# Altium schematic sheet Aq1A_Guppy.SchDoc
size A3; SheetNumber: 1; SheetTotal: 1; SPICEModelCacheADGYIUXI: <root> / <DocumentId>ADGYIUXI</DocumentId> / </root>
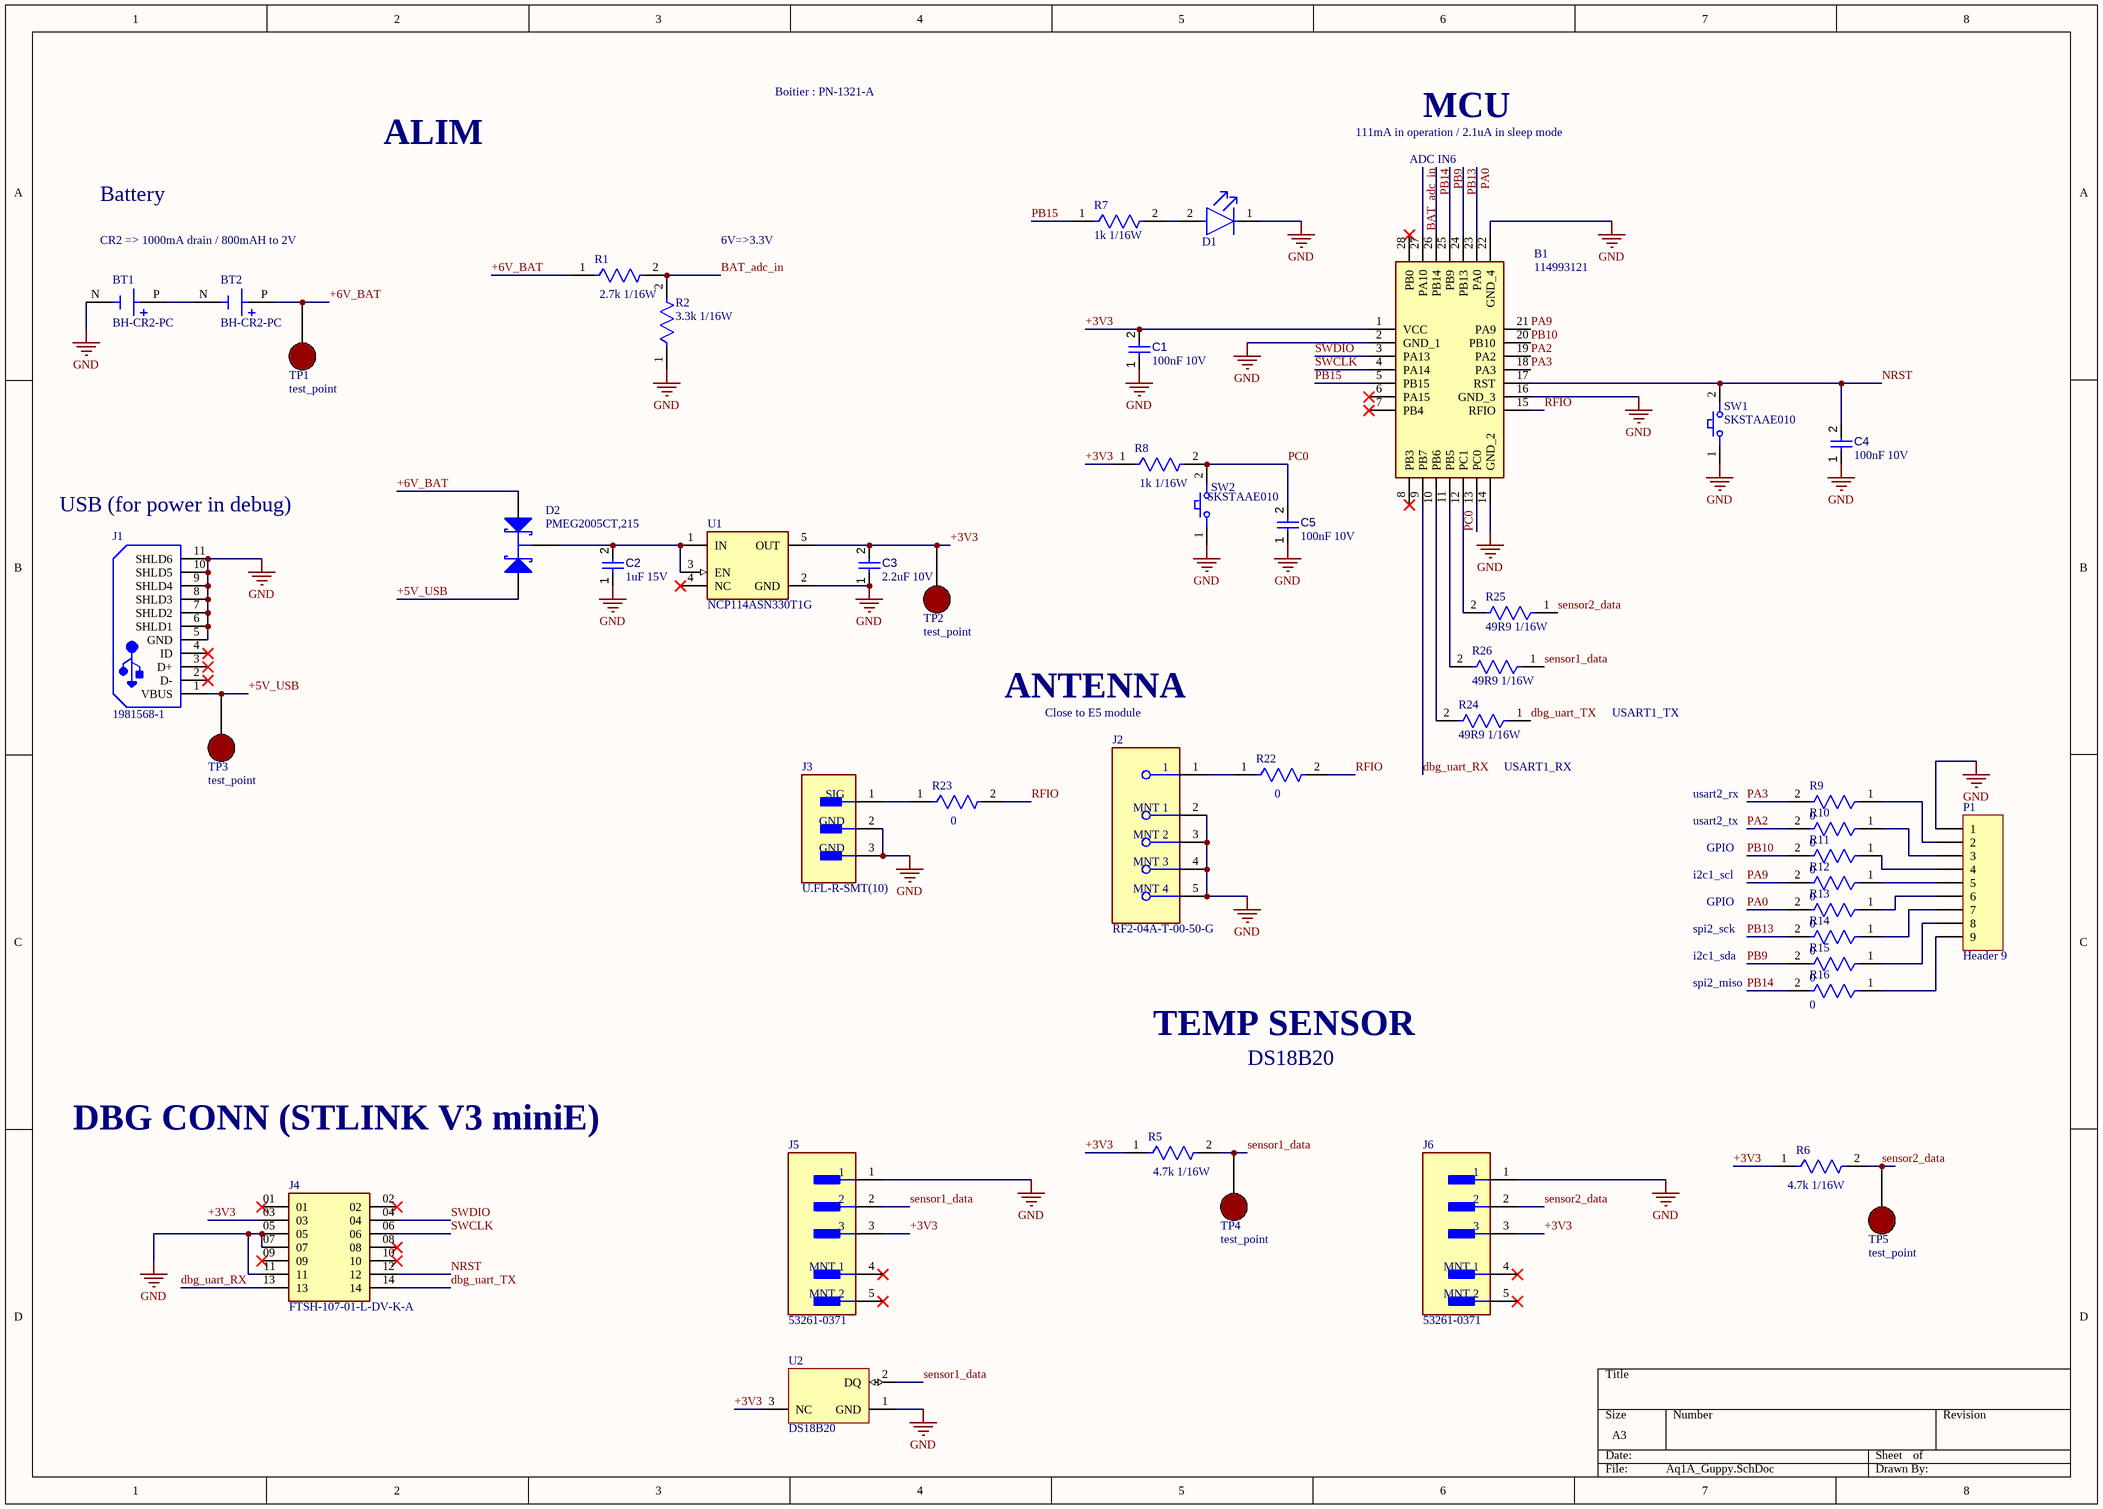
[diagram p0: Aq1A_Guppy.SchDoc]

## Parts
B1  114993121  [114993121]
BT1  BH-CR2-PC  [BAT_BH-CR2-PC]
BT2  BH-CR2-PC  [BAT_BH-CR2-PC]
C1  value 100nF 10V  [CAPC2013X95X50LL10T25]  (hidden comment: Capacitor 100 nF +/-10% 50 V 0805)
C2  value 1uF 15V  [CAPC2013X95X50LL10T25]  (hidden comment: Capacitor 100 nF +/-10% 50 V 0805)
C3  value 2.2uF 10V  [CAPC2013X95X50LL10T25]  (hidden comment: Capacitor 100 nF +/-10% 50 V 0805)
C4  value 100nF 10V  [CAPC2013X95X50LL10T25]  (hidden comment: Capacitor 100 nF +/-10% 50 V 0805)
C5  value 100nF 10V  [CAPC2013X95X50LL10T25]  (hidden comment: Capacitor 100 nF +/-10% 50 V 0805)
D1  SML-D12V8WT86C  [FP-SML-D12-MFG]  (value not drawn)
D2  PMEG2005CT,215  [STM-BAT54CFILM-3_V]
J1  1981568-1  [TECO-1981568-5_V]
J2  RF2-04A-T-00-50-G  [FP-RF2-04A-T-00-50-G-MFG]
J3  U.FL-R-SMT(10)  [FP-U_FL-R-SMT_10-MFG]
J4  FTSH-107-01-L-DV-K-A  [SAMTEC_FTSH-107-01-L-DV-K-A]
J5  53261-0371  [FP-53261-0371-MFG]
J6  53261-0371  [FP-53261-0371-MFG]
P1  Header 9  [HDR1X9]
R1  2.7k 1/16W  [FP-HCJ0805-MFG]
R2  3.3k 1/16W  [FP-HCJ0805-MFG]
R5  4.7k 1/16W  [FP-HCJ0805-MFG]
R6  4.7k 1/16W  [FP-HCJ0805-MFG]
R7  1k 1/16W  [FP-HCJ0805-MFG]
R8  1k 1/16W  [FP-HCJ0805-MFG]
R9  0  [FP-HCJ0805-MFG]
R10  0  [FP-HCJ0805-MFG]
R11  0  [FP-HCJ0805-MFG]
R12  0  [FP-HCJ0805-MFG]
R13  0  [FP-HCJ0805-MFG]
R14  0  [FP-HCJ0805-MFG]
R15  0  [FP-HCJ0805-MFG]
R16  0  [FP-HCJ0805-MFG]
R22  0  [FP-HCJ0805-MFG]
R23  0  [FP-HCJ0805-MFG]
R24  49R9 1/16W  [FP-HCJ0805-MFG]
R25  49R9 1/16W  [FP-HCJ0805-MFG]
R26  49R9 1/16W  [FP-HCJ0805-MFG]
SW1  SKSTAAE010  [FP-SKSTAAE010-MFG]
SW2  SKSTAAE010  [FP-SKSTAAE010-MFG]
TP1  test_point  [test_point]
TP2  test_point  [test_point]
TP3  test_point  [test_point]
TP4  test_point  [test_point]
TP5  test_point  [test_point]
U1  NCP114ASN330T1G  [FP-483-MFG]
U2  DS18B20  [Q3+4]

## Nets
GND: B1.2(GND_1) B1.14(GND_2) B1.16(GND_3) B1.22(GND_4) BT1.N(NEG) C1.1 C2.1 C3.1 C4.1 C5.1 D1.1(C) J1.5(GND) J1.6(SHLD1) J1.7(SHLD2) J1.8(SHLD3) J1.9(SHLD4) J1.10(SHLD5) J1.11(SHLD6) J2.2(MNT_1) J2.3(MNT_2) J2.4(MNT_3) J2.5(MNT_4) J3.2(GND) J3.3(GND) J4.05 J4.07 J4.11 J5.1 J6.1 P1.1 R2.1 SW1.1 SW2.1 U1.2(GND) U2.1(GND)
+3V3: B1.1(VCC) C1.2 C3.2 J4.03 J5.3 J6.3 R5.1 R6.1 R8.1 TP2.0 U1.5(OUT) U2.3(NC)
+5V_USB: D2.2(A) J1.1(VBUS) TP3.0
+6V_BAT: BT2.P(POS) D2.1(A) R1.1 TP1.0
BAT_adc_in: B1.27(PA10) R1.2 R2.2
dbg_uart_RX: B1.9(PB7) J4.13
dbg_uart_TX: J4.14 R24.1
NRST: B1.17(RST) C4.2 J4.12 SW1.2
PA0: B1.23(PA0) R13.2
PA2: B1.19(PA2) R10.2
PA3: B1.18(PA3) R9.2
PA9: B1.21(PA9) R12.2
PB9: B1.25(PB9) R15.2
PB10: B1.20(PB10) R11.2
PB13: B1.24(PB13) R14.2
PB14: B1.26(PB14) R16.2
PB15: B1.5(PB15) R7.1
PC0: B1.13(PC0) C5.2 R8.2 SW2.2
RFIO: B1.15(RFIO) R22.2 R23.2
sensor1_data: J5.2 R5.2 R26.1 TP4.0 U2.2(DQ)
sensor2_data: J6.2 R6.2 R25.1 TP5.0
SWCLK: B1.4(PA14) J4.06
SWDIO: B1.3(PA13) J4.04
NetB1_10: B1.10(PB6) R24.2
NetB1_11: B1.11(PB5) R26.2
NetB1_12: B1.12(PC1) R25.2
NetBT1_P: BT1.P(POS) BT2.N(NEG)
NetC2_2: C2.2 D2.3(K) U1.1(IN) U1.3(EN)
NetD1_2: D1.2(A) R7.2
NetJ2_1: J2.1 R22.1
NetJ3_1: J3.1(SIG) R23.1
NetP1_2: P1.2 R9.1
NetP1_3: P1.3 R10.1
NetP1_4: P1.4 R11.1
NetP1_5: P1.5 R12.1
NetP1_6: P1.6 R13.1
NetP1_7: P1.7 R14.1
NetP1_8: P1.8 R15.1
NetP1_9: P1.9 R16.1

Not connected (* = marked no-connect by the designer): B1 6(PA15)* 7(PB4)* 8(PB3)* 28(PB0)*; J1 2(D-)* 3(D+)* 4(ID)*; J4 01* 02* 08* 09* 10*; J5 4(MNT_1)* 5(MNT_2)*; J6 4(MNT_1)* 5(MNT_2)*; U1 4(NC)*

## Notes on the sheet
- Boitier : PN-1321-A
- ALIM
- 111mA in operation / 2.1uA in sleep mode
- ADC IN6
- MCU
- Battery
- CR2 => 1000mA drain / 800mAH to 2V
- 6V=>3.3V
- (near J1) USB (for power in debug)
- ANTENNA
- Close to E5 module
- USART1_TX
- (near R24) USART1_RX
- usart2_rx
- usart2_tx
- GPIO
- i2c1_scl
- i2c1_sda
- spi2_miso
- spi2_sck
- TEMP SENSOR
- DS18B20
- DBG CONN (STLINK V3 miniE)

## Library data of the parts
B1 = 114993121: General ISM < 1GHz LoRaWAN Transceiver Module 868MHz, 915MHz Antenna Not Included Surface Mount; Manufacturer_Name: Seeed Studio; Geometry.Height: 2.7mm; Mouser Part Number: 713-114993121; Mouser Price/Stock: https://www.mouser.co.uk/ProductDetail/Seeed-Studio/114993121?qs=QpmGXVUTftF1SD6oRXq2Mw%3D%3D; Manufacturer_Part_Number: 114993121; Datasheet Link: https://files.seeedstudio.com/products/114993120/Wio-E5-LE%20module%20datasheet_v1.0.pdf
BT1 BT2 = BH-CR2-PC: BATTERY HOLDER CR2 PC PIN; MF: MPD; MP: BH-CR2-PC; Package: None; SnapEDA_Link: https://www.snapeda.com/parts/BH-CR2-PC/MPD/view-part/4389079/?ref=snap; Check_prices: https://www.snapeda.com/parts/BH-CR2-PC/MPD/view-part/4389079/?ref=eda; Availability: Bad; Value: *; Price: None
C1-C5 = CMP-001-00018-6: Chip Capacitor, 100 nF, +/- 10%, 50 V, 0805 (2012 Metric); Capacitor Type: Ceramic; Voltage Rating: 50V; Pins: 2; Max Operating Temperature: 125°C; Min Operating Temperature: -55°C; Mounting Technology: SM; Case/Package: 0805; RoHS Compliant: True; Tolerance: 10%
D1 = CMP-08952-000027-1: LED RED 1608 SMD; Forward Voltage: 2.2V; Luminous Intensity: 40mcd; Lens Size: 0.8mm; Lens Style: Flat; Lens Color: White; Test Current: 20mA; Dominant Wavelength: 630nm; Height: 0.65mm; Length: 1.6mm; Case Code (Metric): 1608; Color: Red; Mount: Surface Mount; Width: 0.8mm; Case Code (Imperial): 0603; Case/Package: 0603; Packaging: Tape and Reel
D2 = CMP-2000-05362-1: Small Signal Schottky Diode, 40 V, -40 to 150 degC, 3-Pin SOT23, RoHS, Tape and Reel; Manufacturer: STMicroelectronics; Forward Surge Current Ifsm Max: 1A; No. of Pins: 3Pins; Repetitive Reverse Voltage Vrrm Max: 30V; Product Range: BAT54Series; SVHC: NoSVHC(17-Dec-2015); Forward Voltage VF Max: 900mV; Diode Configuration: DualCommonCathode; Forward Current If(AV): 300mA; Diode Case Style: SOT-23; Package Reference: BAT54CFILM-3; Operating Temperature Max: 150degC; Datasheet Version: Rev. 11, 02/2015; Package Description: 3-Pin Small OutLine Transistor, Body 2.895 x 1.475 mm, Height 1.4 mm; Packaging: CutTape; Datasheet URL: http://www2.st.com/content/ccc/resource/technical/document/datasheet/07/50/54/f2/0d/ba/4a/79/CD00001322.pdf/files/CD00001322.pdf/jcr:content/translations/en.CD00001322.pdf; Manufacturer URL: http://www.st.com/; Automotive Qualification Standard: -; Package URL: http://www2.st.com/content/ccc/resource/technical/document/datasheet/07/50/54/f2/0d/ba/4a/79/CD00001322.pdf/files/CD00001322.pdf/jcr:content/translations/en.CD00001322.pdf
J1 = CMP-2000-05408-1: Micro USB Receptacle Standard Type B Assy, 5-Pin SMD, RoHS, Tape and Reel; Manufacturer: TE Connectivity; Body Orientation: RightAngle; Number of Ports: 1Port; Number of Contacts: 5POS; Gender: RCP; Voltage Rating Max: 30VAC; Product Depth (mm): 5.6mm; Pitch (mm): 0.65mm; Current Rating (Max): 1/ContactA; Product Length (mm): 8mm; Product Height (mm): 3mm; Operating Temperature Max Deg. C: 85C; Datasheet URL: http://www.mouser.com/ds/2/418/NG_CD_1981568_E2-621296.pdf; Termination Method: Solder; Number of Terminals: 5; Operating Temp Range: -55Cto85C; Mounting Style: SurfaceMount; Manufacturer URL: http://www.te.com/; Contact Material: CopperAlloy; Packaging: TapeandReel; Datasheet Version: Rev. E2, 08/2015; Operating Temperature Min Deg. C: -55C; Housing Material: Thermoplastic; Type: MicroUSB; Contact Plating: GoldOverNickel
J2 = CMP-42753-000002-1: CONN SMA JACK STR 50 OHM PCB
J3 = CMP-0029-00003-2: CONN U.FL RCPT STR 50 OHM SMD; Plating: Silver; Connector Type: Coaxial; Frequency: 6GHz; Impedance: 50R; Body Material: Bronze; Dielectric Material: Polymer; Contact Plating: Gold; Termination: Solder; Orientation: Vertical; Contact Material: Brass; Min Operating Temperature: -40°C; Mount: Surface Mount; Lead Free: Lead Free; Max Operating Temperature: 90°C; Radiation Hardening: No; Packaging: Tape and Reel; Body Plating: Silver; Fastening Type: Snap; Max Frequency: 6GHz; Depth: 3.1mm; Package Quantity: 1; Case/Package: SMD/SMT; Housing Color: Beige; Length: 3mm
J4 = FTSH-107-01-L-DV-K-A: Connector Header Surface Mount 14 position 0.050 (1.27mm); MF: Samtec Inc.; SnapEDA_Link: https://www.snapeda.com/parts/FTSH-107-01-L-DV-K-A/Samtec+Inc./view-part/?ref=snap; Package: None; Value: *; MP: FTSH-107-01-L-DV-K-A; Check_prices: https://www.snapeda.com/parts/FTSH-107-01-L-DV-K-A/Samtec+Inc./view-part/?ref=eda
J5 J6 = CMP-04776-000071-1: CONN HEADER SMD R/A 3POS 1.25MM; Manufacturer: Molex; Number Of Contacts: 3; Conn Orientation: Right Angle; Current Rating: 1A; Voltage Rating: 125V; Conn Gender: Male; Category: Conn; Automotive: No; Footprint Url: https://www.molex.com/pdm_docs/sd/532610371_sd.pdf; Height: 3.6mm; Number Of Rows: 1; Temperature Range Low: -40°C; Package: 0; Octopart: https://octopart.com/53261-0371-molex-655314; ComponentLink2Description: Datasheet; Lead Free: Yes; Ambient Temperature Range Low: -40°C; Device Class L3: unset; Mouser Description: 1.25mm (.049") Pitch PicoBlade Header, Surface Mount, Right Angle, Lead-free, 3 Circuits; Digikey Description: CONN HEADER SMD R/A 3POS 1.25MM; Device Class L2: Headers and Wire Housings; Contact Material: Tin,Nickel; Manufacturer Part Number: 53261-0371; Ambient Temperature Range High: +105°C; ComponentLink2URL: https://www.molex.com/webdocs/datasheets/pdf/en-us/0532610371_PCB_HEADERS.pdf; Pitch: 1.25mm; Temperature: -40°C to +105°C; RoHS: TRUE; Device Class L1: Connectors; Temperature Range High: +105°C
P1 = Header 9: Header, 9-Pin; LatestRevisionDate: 17-Jul-2002; LatestRevisionNote: Re-released for DXP Platform.; Publisher: Altium Limited
R1 R2 R5-R16 R22-R26 = CMP-26527-000104-1: RES 0 OHM JUMPER 1/2W 0805; Resistance: 0mR; Radiation Hardening: No; Case Code (Imperial): 0805; Number of Terminations: 2; Lead Free: Lead Free; Max Operating Temperature: 155°C; Width: 0.049inch; Case Code (Metric): 2012; Height: 0.026inch; Mount: Surface Mount; Min Operating Temperature: -55°C; Packaging: Tape and Reel; Package Quantity: 1; Termination: Wraparound; Length: 0.079inch; RoHS Compliant: Yes; Case/Package: 0805
SW1 SW2 = CMP-24311-000002-1: Tactile Switches Quiet 0.9mm Middle Stroke, 4N,500KCycle; Lead Free: Lead Free
U1 = CMP-07128-000001-1: IC REG LINEAR 3.3V 300MA 5TSOP; Manufacturer: ON Semiconductor; Dropout Voltage: 150mV; Number Of Outputs: 1; Output Type: Fixed; Standoff Height: 0.01mm; Nominal Supply Current: 50uA; Accuracy Percentage: 1%; Max Junction Temp: +150°C; Min Supply Voltage: 1.7V; Max Supply Voltage: 5.5V; Output Voltage: 3.3V; Device Class L2: Power Management ICs; Digikey Description: IC REG LINEAR 3.3V 300MA 5TSOP; Footprint Url: https://www.onsemi.com/pub/Collateral/483.PDF; Temperature: to +150°C; RoHS: TRUE; Octopart: https://octopart.com/ncp114asn330t1g-on+semiconductor-74628742; Package: 483; Height: 1.1mm; Device Class L1: Integrated Circuits (ICs); Device Class L3: Voltage Regulators - Linear; ComponentLink2URL: https://www.onsemi.com/pub/Collateral/NCP114-D.PDF; Output Current: 300mA; Automotive: No; ComponentLink2Description: Datasheet; Manufacturer Part Number: NCP114ASN330T1G; Category: IC; Lead Free: Yes; Temperature Range High: +150°C
U2 = CMP-0253-00002-1: High-Precision Parasite-Power Digital Thermometer, 1-Wire Interface, ±0.5°C Accuracy, 3-Pin TO92, -55°C to +125°C, Tape and Reel, Pb-Free; ComponentLink1URL: http://www.maxim-ic.com; PackageDescription: TO-92 Package, Formed Leads, Body Dia. 4.7mm; Leads 0.51 x 0.51 mm (max), Pb-Free; ComponentLink1Description: Manufacturer URL; ComponentLink2URL: http://datasheets.maxim-ic.com/en/ds/DS18B20-PAR.pdf; Code_JEDEC: TO-226-AA; DatasheetVersion: 2007; ComponentLink2Description: Datasheet; PackageReference: Q3+4; PackageVersion: revB, 2010